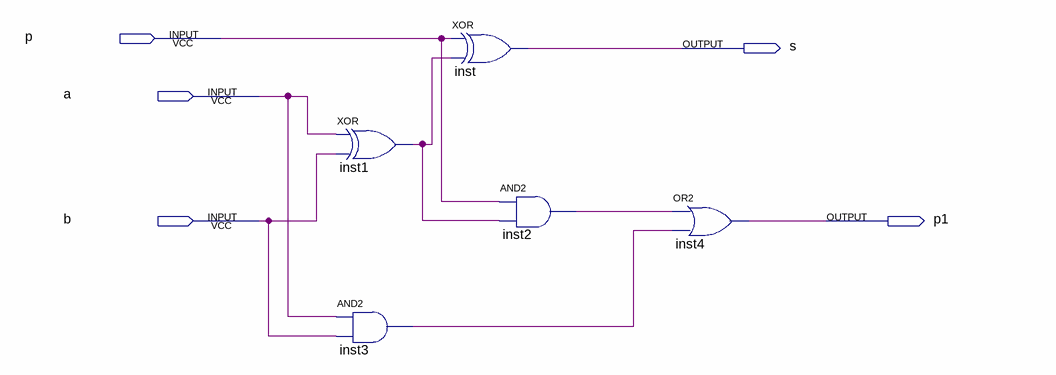
[diagram p0: schematic sheet]
// Quartus schematic one_digit_sum.bdf as structural Verilog: 5 symbols, 5 pins
module one_digit_sum (
  input  p,
  input  a,
  input  b,
  output s,
  output p1
);

  wire inst1_out, inst2_out, inst3_out;

  xor inst1 (inst1_out, a, b);
  and inst3 (inst3_out, a, b);
  xor inst (s, p, inst1_out);
  and inst2 (inst2_out, p, inst1_out);
  or inst4 (p1, inst2_out, inst3_out);
endmodule
